# Altium schematic sheet DSO_Front.SchDoc: Schematic_Name
size A4; CompanyName: University of Melbourne; Engineer: Your Name Here; DocumentNumber: 1; Revision: 0.1; SheetNumber: 1; SheetTotal: 1; Title_Project: Project_Title; StudentNo: Student No.
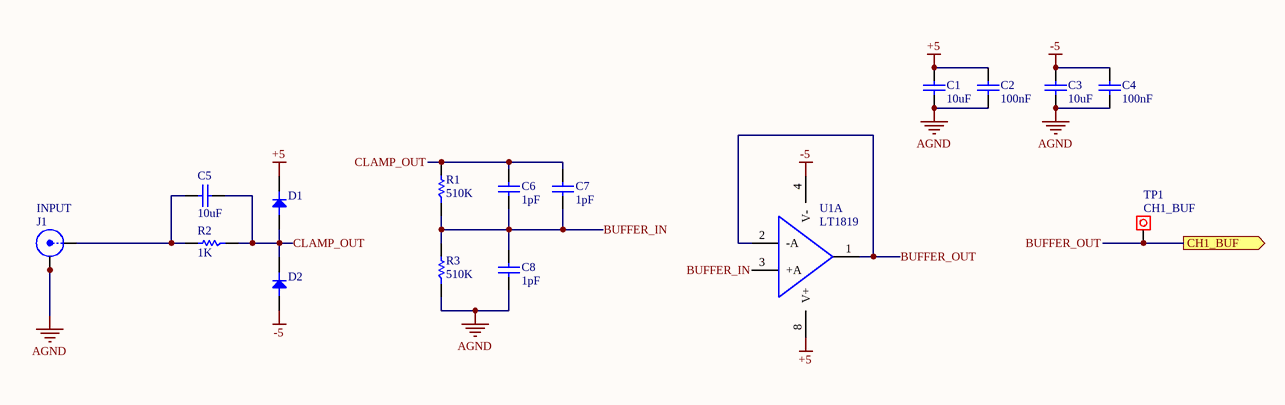
[diagram p0: DSO_Front.SchDoc]

## Parts
C1  10uF  [0805C]
C2  100nF  [0805C]
C3  10uF  [0805C]
C4  100nF  [0805C]
C5  10uF  [0805C]
C6  1pF  [0805C]
C7  1pF  [0805C]
C8  1pF  [0805C]
D1  Diode  [SOD-123]  (value not drawn)
D2  Diode  [SOD-123]  (value not drawn)
J1  INPUT  [BNC_VERT]
R1  510K  [0805]
R2  1K  [0805]
R3  510K  [0805]
TP1  CH1_BUF  [Testpoin]  (no BOM)
U1  LT1819  [SOIC-8]  (part A of 2)

## Ports
CH1_BUF (out)

## Nets
+5: C1.1 C2.1 D1.K U1.8(V+)
-5: C3.1 C4.1 D2.A U1.4(V-)
AGND: C1.2 C2.2 C3.2 C4.2 C8.2 J1.2(Y) J1.3(Y) J1.4(Y) J1.5(Y) R3.1
BUFFER_IN: C6.2 C7.2 C8.1 R1.1 R3.2 U1.3(+A)
BUFFER_OUT: TP1.1 U1.1(OUTA) U1.2(-A) ; port CH1_BUF
CLAMP_OUT: C5.1 C6.1 C7.1 D1.A D2.K R1.2 R2.1
NetC5_2: C5.2 J1.1(X) R2.2

## Library data of the parts
C1-C8 = C: Capacitor; Reviewed by: RM - 2018/08/05; Revision: July-2002: Re-released for DXP Platform.; Supplier 1: *; Supplier Part Number 1: *
  C1 C3 C5: Value: 10uF
  C2 C4: Value: 100nF
  C6-C8: Value: 1pF
D1 D2 = D: Reviewed by: RM - 2018/08/05; Revision: July-2002: Re-released for DXP Platform.; Supplier 1: *; Supplier Part Number 1: *
J1 = BNC: BNC Straight; Reviewed by: RM - 2018/08/05; Supplier Part Number 1: A97581-ND; Supplier 1: Digi-Key
R1-R3 = R: Resistor; Reviewed by: RM - 2018/08/05; Supplier 1: *; Suppler Part Number 1: *
  R1 R3: Value: 510K
  R2: Value: 1K
TP1 = Test Point: Pad; Value: CH1_BUF
U1 = LT1819: OpAmp High Frequency Dual; Reviewed by: RM - 2018/08/05; Supplier 1: Digi-Key; Supplier Part Number 1: LT1819CMS8#PBF-ND